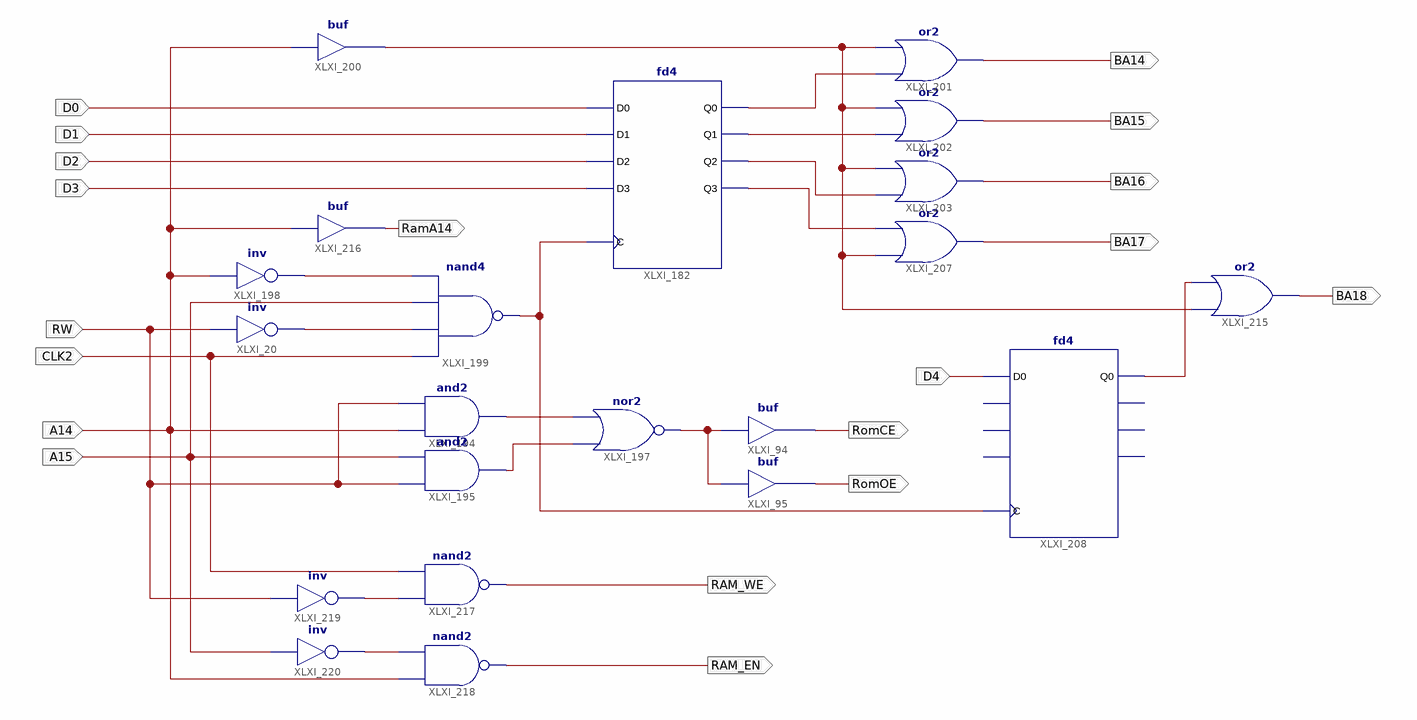
[diagram p0: schematic sheet 1]
// Xilinx ISE schematic A78maxi_512k_RAM.sch (xc9500xl) as structural Verilog: 21 symbols, 19 ports
module A78maxi_512k_RAM (
  input  D0,
  input  D1,
  input  D2,
  input  A14,
  input  D3,
  input  CLK2,
  input  RW,
  input  A15,
  input  D4,
  output RomCE,
  output RomOE,
  output RAM_EN,
  output RAM_WE,
  output BA17,
  output BA16,
  output BA15,
  output BA14,
  output BA18,
  output RamA14
);

  wire XLXN_114, XLXN_128, XLXN_221, XLXN_272, XLXN_277, XLXN_285, XLXN_286, XLXN_289, XLXN_308, XLXN_309,
       XLXN_312, XLXN_341, XLXN_350, XLXN_352;

  not XLXI_20 (XLXN_128, RW);
  buf XLXI_95 (RomOE, XLXN_114);
  buf XLXI_94 (RomCE, XLXN_114);
  and XLXI_194 (XLXN_286, A14, RW);
  and XLXI_195 (XLXN_285, RW, A15);
  nor XLXI_197 (XLXN_114, XLXN_285, XLXN_286);
  not XLXI_198 (XLXN_289, A14);
  nand XLXI_199 (XLXN_221, CLK2, XLXN_128, A15, XLXN_289);
  buf XLXI_200 (XLXN_277, A14);
  fd4 XLXI_208 (.C(XLXN_221), .D0(D4), .Q0(XLXN_341));  // open: D1, D2, D3, Q1, Q2, Q3
  or XLXI_207 (BA17, XLXN_277, XLXN_312);
  or XLXI_202 (BA15, XLXN_272, XLXN_277);
  or XLXI_203 (BA16, XLXN_309, XLXN_277);
  or XLXI_201 (BA14, XLXN_308, XLXN_277);
  fd4 XLXI_182 (
    .C(XLXN_221), .D0(D0), .D1(D1), .D2(D2), .D3(D3), .Q0(XLXN_308), .Q1(XLXN_272), .Q2(XLXN_309),
    .Q3(XLXN_312));
  or XLXI_215 (BA18, XLXN_277, XLXN_341);
  buf XLXI_216 (RamA14, A14);
  nand XLXI_217 (RAM_WE, XLXN_350, CLK2);
  nand XLXI_218 (RAM_EN, A14, XLXN_352);
  not XLXI_219 (XLXN_350, RW);
  not XLXI_220 (XLXN_352, A15);

  // Notes on the sheet:
  //   LOC on signal D0 = 23
  //   LOC on signal D1 = 22
  //   LOC on signal D2 = 21
  //   LOC on signal A14 = 37
  //   LOC on signal RomCE = 8
  //   LOC on signal RomOE = 18
  //   LOC on signal D3 = 20
  //   LOC on signal CLK2 = 44
  //   LOC on signal RAM_EN = 7
  //   LOC on signal RAM_WE = 40
  //   LOC on signal RW = 43
  //   LOC on signal A15 = 36
  //   LOC on signal BA17 = 41
  //   LOC on signal BA16 = 38
  //   LOC on signal BA15 = 33
  //   LOC on signal BA14 = 42
  //   LOC on signal BA18 = 39
  //   LOC on signal D4 = 19
  //   LOC on signal RamA14 = 6
endmodule
